# Altium project vias.PrjPcb
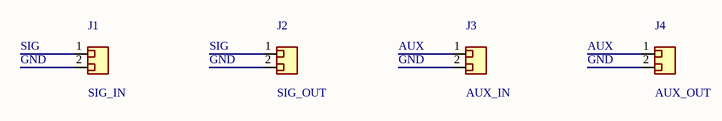
[diagram p0: vias.SchDoc]
1 sheet, 4 parts. Net scope: global (net labels, ports and power ports of the same name join across sheets).
Board file: vias.PcbDoc

## Sheet vias.SchDoc
size A4

### Parts
J1  SIG_IN  [Header_1x2_P2.54]
J2  SIG_OUT  [Header_1x2_P2.54]
J3  AUX_IN  [Header_1x2_P2.54]
J4  AUX_OUT  [Header_1x2_P2.54]

### Nets
AUX: J3.1(Passive) J4.1(Passive)
GND: J1.2(Passive) J2.2(Passive) J3.2(Passive) J4.2(Passive)
SIG: J1.1(Passive) J2.1(Passive)

### Library data of the parts
J1-J4 = Connector_2